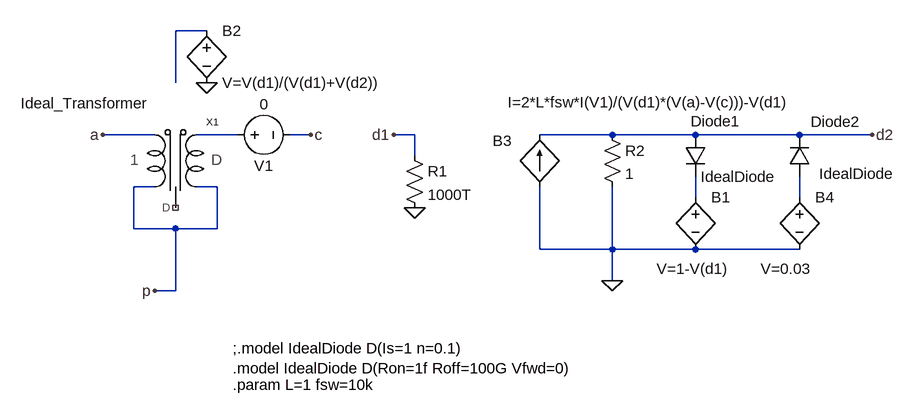
[diagram p0: schematic DCM_VM_transformer_model.asc]
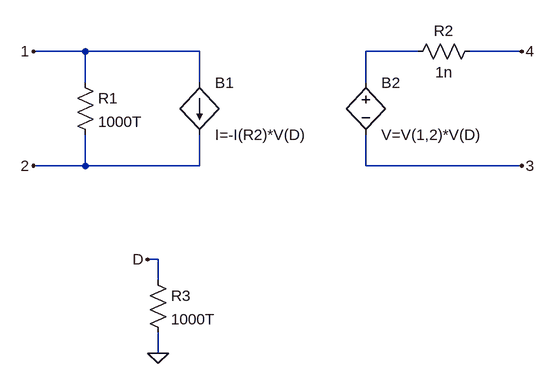
[diagram p1: sub-circuit ideal_transformer.asc]
DCM_VM_transformer_model.asc, the LTspice schematic file:
Version 4
SHEET 1 1344 680
WIRE 240 -16 192 -16
WIRE 192 64 192 -16
WIRE 160 144 80 144
WIRE 288 144 224 144
WIRE 400 144 368 144
WIRE 560 144 528 144
WIRE 864 144 752 144
WIRE 992 144 864 144
WIRE 1152 144 992 144
WIRE 1264 144 1152 144
WIRE 560 176 560 144
WIRE 160 224 128 224
WIRE 256 224 224 224
WIRE 992 240 992 208
WIRE 1152 240 1152 208
WIRE 128 288 128 224
WIRE 192 288 128 288
WIRE 256 288 256 224
WIRE 256 288 192 288
WIRE 752 320 752 224
WIRE 864 320 864 224
WIRE 864 320 752 320
WIRE 992 320 864 320
WIRE 1152 320 992 320
WIRE 864 368 864 320
WIRE 192 384 192 288
WIRE 192 384 160 384
FLAG 240 64 0
FLAG 528 144 d1
FLAG 560 256 0
FLAG 864 368 0
FLAG 1264 144 d2
FLAG 400 144 c
FLAG 80 144 a
FLAG 160 384 p
SYMBOL ideal_transformer 144 128 R0
WINDOW 3 -190 -33 Left 2
SYMATTR InstName X1
SYMBOL bv 992 224 R0
WINDOW 3 -60 126 Left 2
SYMATTR Value V=1-V(d1)
SYMATTR InstName B1
SYMBOL bv 240 -32 R0
SYMATTR InstName B2
SYMATTR Value V=V(d1)/(V(d1)+V(d2))
SYMBOL res 544 160 R0
SYMATTR InstName R1
SYMATTR Value 1000T
SYMBOL diode 976 144 R0
WINDOW 0 9 -21 Left 2
SYMATTR InstName Diode1
SYMATTR Value IdealDiode
SYMBOL bi2 752 144 R0
WINDOW 0 -72 9 Left 2
WINDOW 3 -49 -50 Left 2
SYMATTR InstName B3
SYMATTR Value I=2*L*fsw*I(V1)/(V(d1)*(V(a)-V(c)))-V(d1)
SYMBOL res 848 128 R0
SYMATTR InstName R2
SYMATTR Value 1
SYMBOL diode 1168 208 R180
WINDOW 0 -78 84 Left 2
WINDOW 3 -130 4 Left 2
SYMATTR InstName Diode2
SYMATTR Value IdealDiode
SYMBOL bv 1152 224 R0
WINDOW 3 -60 126 Left 2
SYMATTR Value V=0.03
SYMATTR InstName B4
SYMBOL voltage 272 144 R270
WINDOW 0 -32 56 VBottom 2
WINDOW 3 32 56 VTop 2
WINDOW 123 0 0 Left 0
WINDOW 39 0 0 Left 0
SYMATTR InstName V1
SYMATTR Value 0
TEXT 280 472 Left 2 !;.model IdealDiode D(Is=1 n=0.1)\n.model IdealDiode D(Ron=1f Roff=100G Vfwd=0)
TEXT 280 528 Left 2 !.param L=1 fsw=10k

ideal_transformer.asc, the sub-circuit schematic file:
Version 4
SHEET 1 880 680
WIRE -192 80 -272 80
WIRE -16 80 -192 80
WIRE 320 80 240 80
WIRE 480 80 400 80
WIRE -192 128 -192 80
WIRE -16 128 -16 80
WIRE 240 128 240 80
WIRE -192 256 -192 208
WIRE -192 256 -272 256
WIRE -16 256 -16 208
WIRE -16 256 -192 256
WIRE 240 256 240 208
WIRE 480 256 240 256
WIRE -80 400 -96 400
WIRE -80 432 -80 400
WIRE -80 544 -80 512
FLAG -80 544 0
FLAG -96 400 D
FLAG -272 80 1
FLAG -272 256 2
FLAG 480 80 4
FLAG 480 256 3
SYMBOL res -208 112 R0
SYMATTR InstName R1
SYMATTR Value 1000T
SYMBOL res 416 64 R90
WINDOW 0 0 56 VBottom 2
WINDOW 3 32 56 VTop 2
SYMATTR InstName R2
SYMATTR Value 1n
SYMBOL bi -16 128 R0
SYMATTR InstName B1
SYMATTR Value I=-I(R2)*V(D)
SYMBOL res -96 416 R0
SYMATTR InstName R3
SYMATTR Value 1000T
SYMBOL bv 240 112 R0
SYMATTR InstName B2
SYMATTR Value V=V(1,2)*V(D)

The netlist it stands for:
* DCM_VM_transformer_model.asc
XX1 a p p N002 NC_01 ideal_transformer params: Ideal_Transformer
B1 N003 0 V=1-V(d1)
B2 N001 0 V=V(d1)/(V(d1)+V(d2))
R1 d1 0 1000T
Diode1 d2 N003 IdealDiode
B3 0 d2 I=2*L*fsw*I(V1)/(V(d1)*(V(a)-V(c)))-V(d1)
R2 d2 0 1
Diode2 N004 d2 IdealDiode
B4 N004 0 V=0.03
V1 N002 c 0

* block symbol definitions
.subckt ideal_transformer 1 2 3 4 D
R1 1 2 1000T
R2 4 N001 1n
B1 1 2 I=-I(R2)*V(D)
R3 D 0 1000T
B2 N001 3 V=V(1,2)*V(D)
.ends ideal_transformer

.model D D
.lib standard.dio
;.model IdealDiode D(Is=1 n=0.1)
.model IdealDiode D(Ron=1f Roff=100G Vfwd=0)
.param L=1 fsw=10k
.backanno
.end